# Altium schematic sheet Nguon.SchDoc
size A; SheetNumber: 2; SheetTotal: 6
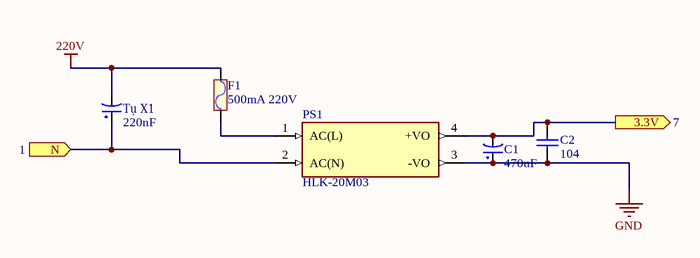
[diagram p0: Nguon.SchDoc]

## Parts
C1  470uF  [tu hoa 16mm]
C2  104  [tu gom]
F1  500mA 220V  [Cau chi tu phuc hoi 2A 24V SMD1812]
PS1  HLK-20M03  [CONV_HLK-20M05]
Tụ_X1  220nF  [tu hoa 8mm]

## Ports
3.3V (out, see 7), N (in, see 1)

## Nets
220V: F1.2 Tụ_X1.2
GND: C1.1 C2.2 PS1.3(-VO)
3.3V: C1.2 C2.1 PS1.4(+VO) ; port 3.3V
N: PS1.2(AC(N)) Tụ_X1.1 ; port N
NetF1_1: F1.1 PS1.1(AC(L))

## Library data of the parts
C1 = Tu Hoa 470uF 100V 16x25: Cắm; Don_Vi: Con; So_Chan: 2; Ten_Linh_Kien: Tụ Hóa 470uF 100V 16x25MM; Ma_Hang: MH008785; Chung_Loai: Cắm; Kieu_Chan: *
C2 = Tu gom 104 50V: Cắm; So_Chan: 2; Ten_Linh_Kien: Tụ gốm 104 100nF 50V; Don_Vi: Con; Ma_Hang: MH004761; Chung_Loai: Cắm; Kieu_Chan: *
F1 = Cau chi tu phuc hoi 2A 24V SMD1812: 2A 24V SMD1812; Ma_Hang: MH010033; Ten: Cầu Chì Tự Phục Hồi 2A 24V SMD1812
PS1 = HLK-20M05: 20W ultra-small series module power supply; MF: Hi-link; Value: *; Package: Non-Standard Hi-link; MP: HLK-20M05; Check_prices: https://www.snapeda.com/parts/HLK-20M05/Hi-link/view-part/?ref=eda; SnapEDA_Link: https://www.snapeda.com/parts/HLK-20M05/Hi-link/view-part/?ref=snap; Price: None; Availability: Not in stock
Tụ_X1 = Tu Hoa 220uF 35V 8x12: Cắm; Don_Vi: Con; So_Chan: 2; Ten_Linh_Kien: Tụ Hóa 220uF 35V 8x12MM; Ma_Hang: MH006553; Chung_Loai: Cắm; Kieu_Chan: *